# Altium schematic sheet Led.SchDoc
size A4
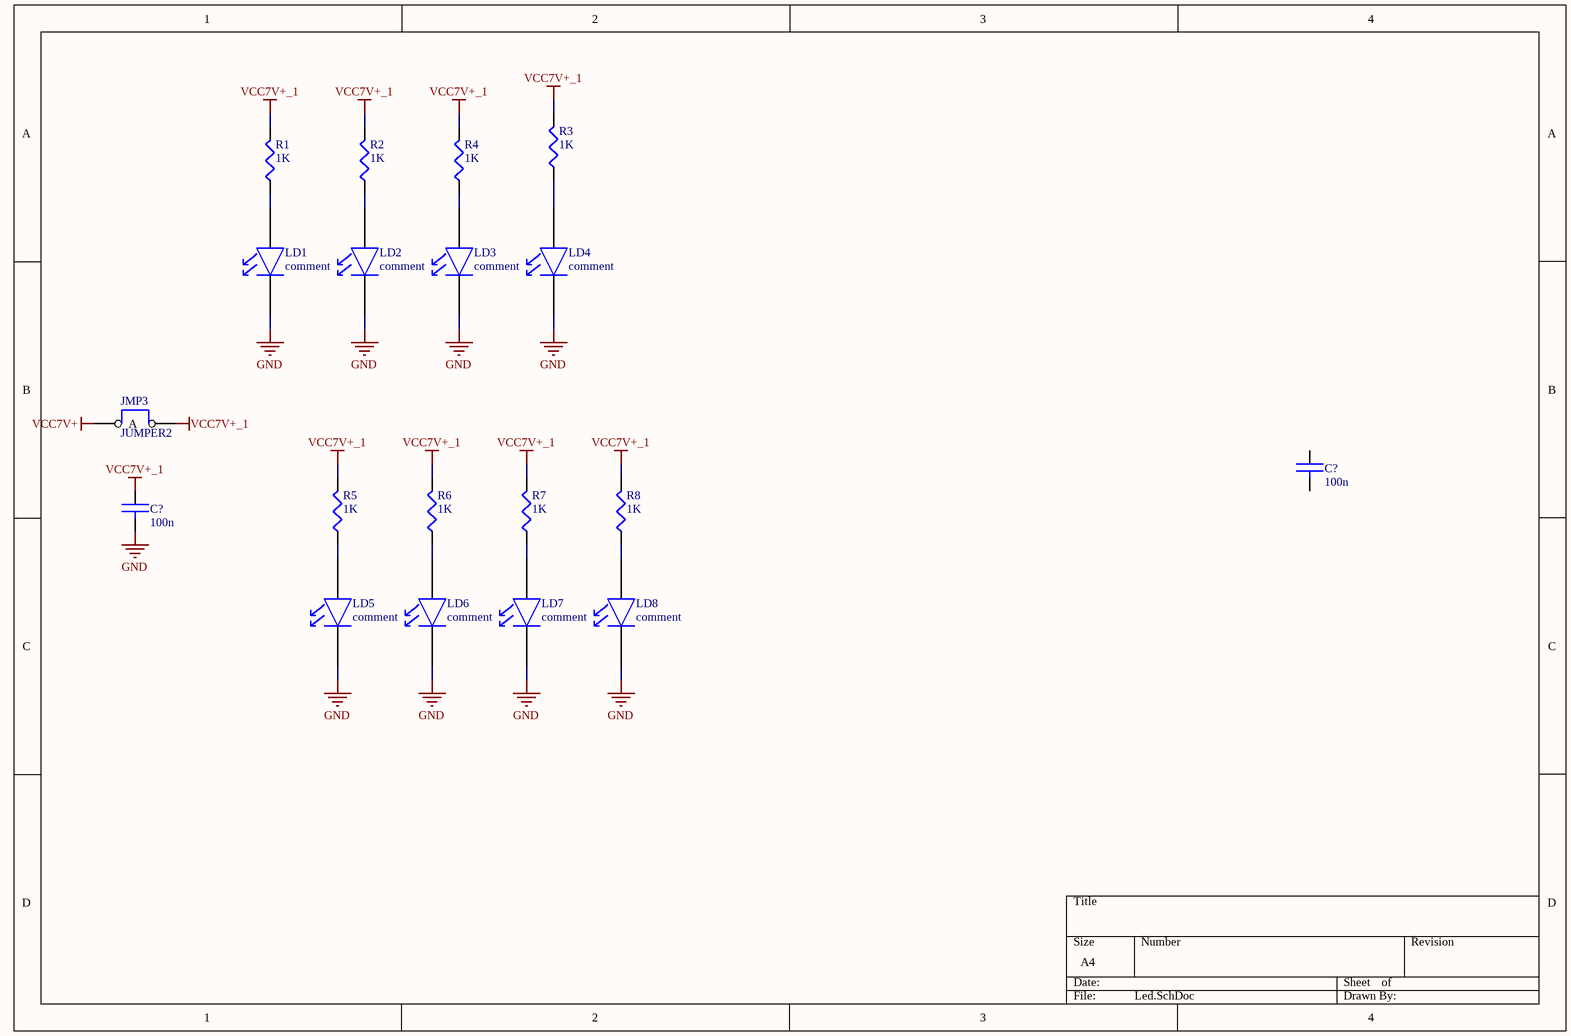
[diagram p0: Led.SchDoc]

## Parts
(Parts that share a designator on the sheet are numbered #1, #2 ... from top to bottom, then left to right.)
C?#1  value 100n  [0402]  (hidden comment: CAP)
C?#2  value 100n  [0805]  (hidden comment: CAP)
JMP3  JUMPER2  [JMP2-100]
LD1  comment  [LED0805]
LD2  comment  [LED0805]
LD3  comment  [LED0805]
LD4  comment  [LED0805]
LD5  comment  [LED0805]
LD6  comment  [LED0805]
LD7  comment  [LED0805]
LD8  comment  [LED0805]
R1  value 1K  [0805]  (hidden comment: RES)
R2  value 1K  [0805]  (hidden comment: RES)
R3  value 1K  [0805]  (hidden comment: RES)
R4  value 1K  [0805]  (hidden comment: RES)
R5  value 1K  [0805]  (hidden comment: RES)
R6  value 1K  [0805]  (hidden comment: RES)
R7  value 1K  [0805]  (hidden comment: RES)
R8  value 1K  [0805]  (hidden comment: RES)

## Nets
GND: C?#2.2 LD1.K LD2.K LD3.K LD4.K LD5.K LD6.K LD7.K LD8.K
VCC7V+: JMP3.1(A)
VCC7V+_1: C?#2.1 JMP3.2(com) R1.2 R2.2 R3.2 R4.2 R5.2 R6.2 R7.2 R8.2
NetLD1_A: LD1.A R1.1
NetLD2_A: LD2.A R2.1
NetLD3_A: LD3.A R4.1
NetLD4_A: LD4.A R3.1
NetLD5_A: LD5.A R5.1
NetLD6_A: LD6.A R6.1
NetLD7_A: LD7.A R7.1
NetLD8_A: LD8.A R8.1

Not connected (* = marked no-connect by the designer): C?#1 1 2

## Library data of the parts
C?#1 C?#2 = CAP: capacité non polarisée
JMP3 = JUMPER2: cavalier 1 position
LD1-LD8 = LED: LED 5mm/3mm/CMS
R1-R8 = RES: resistance